# Altium project USB TO 4CHANNEL TTL CONVERTER.PrjPcb
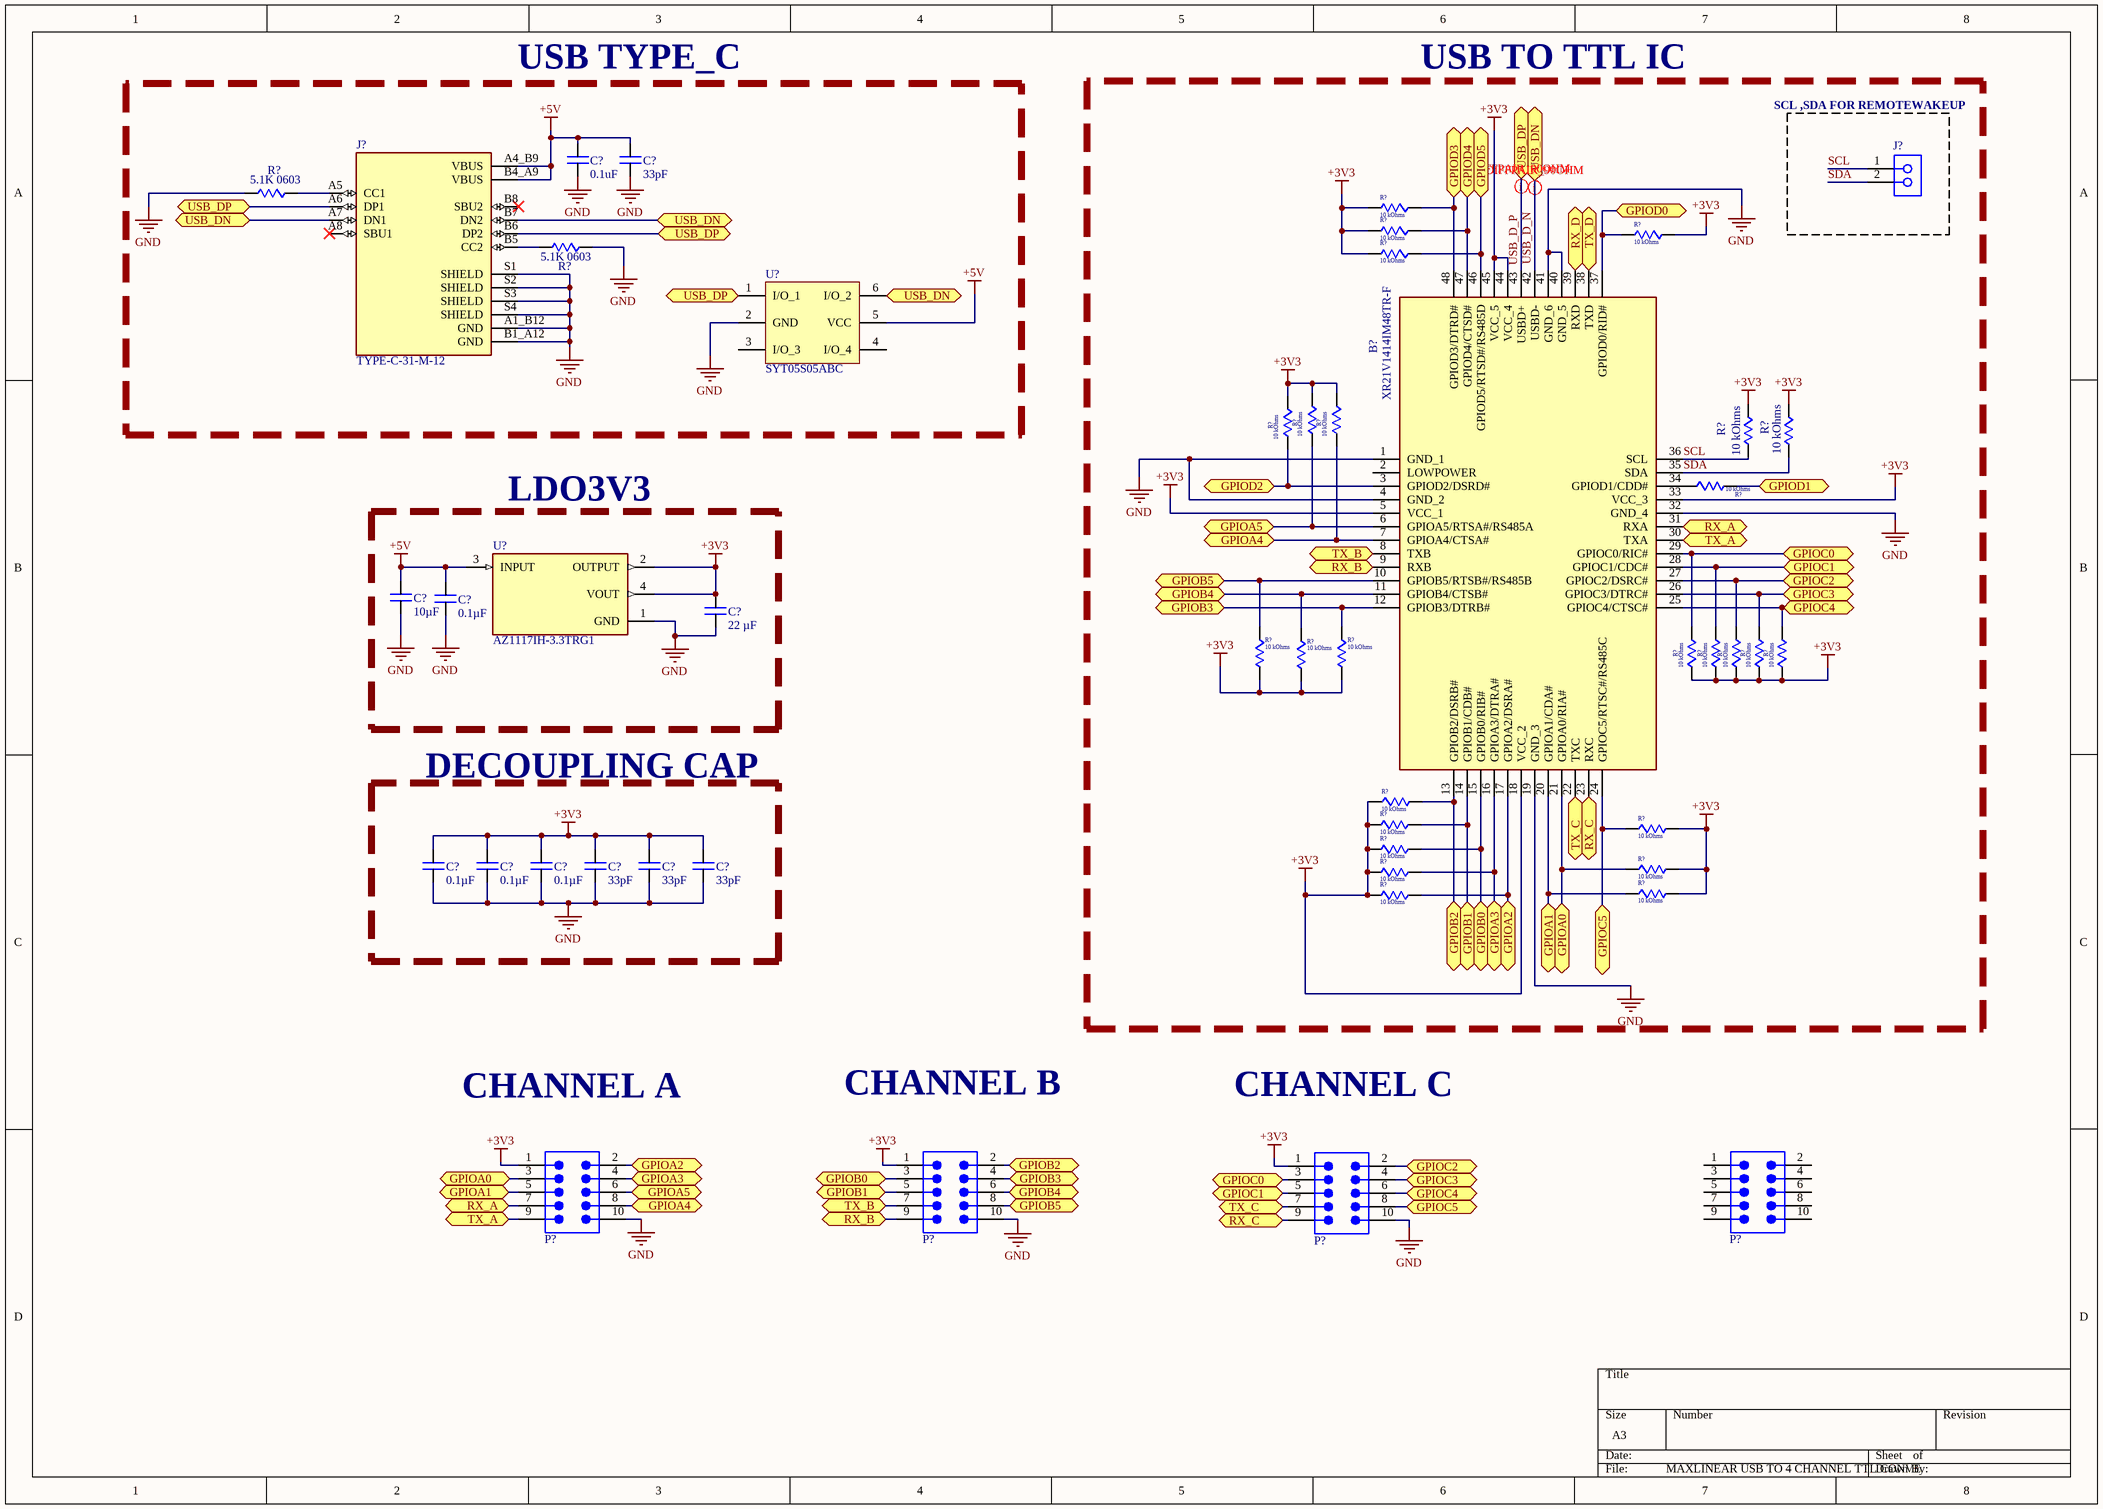
[diagram p0: MAXLINEAR USB TO 4 CHANNEL TTL CONVERTER.SchDoc]
1 sheet, 48 parts. Net scope: flat (ports and power ports of the same name join across sheets).
Board file: USB TO TTL PCB.PcbDoc

## Sheet MAXLINEAR USB TO 4 CHANNEL TTL CONVERTER.SchDoc
size A3; SheetNumber: 1; SheetTotal: 1

### Parts
(Parts that share a designator on the sheet are numbered #1, #2 ... from top to bottom, then left to right.)
B1  XR21V1414IM48TR-F  [QFP50P900X900X120-48N]
C1  value 0.1uF  [CAPC1608X90N]  (hidden comment: 0.1 µF)
C2  value 33pF  [CAPC1608X90N]  (hidden comment: 33 pF)
C3  value 0.1µF  [CAPC1608X90N]  (hidden comment: 0.1 µF)
C4  value 0.1µF  [CAPC1608X90N]  (hidden comment: 0.1 µF)
C5  value 0.1µF  [CAPC1608X90N]  (hidden comment: 0.1 µF)
C6  value 33pF  [CAPC1608X90N]  (hidden comment: 33 pF)
C7  value 33pF  [CAPC1608X90N]  (hidden comment: 33 pF)
C8  value 33pF  [CAPC1608X90N]  (hidden comment: 33 pF)
C10  value 10µF  [CAP-0805]  (hidden comment: 10 µF)
C12  value 0.1µF  [CAP-0805]  (hidden comment: 0.1 µF)
C14  22 µF  [CAPC1608X90N]
J1  TYPE-C-31-M-12  [HRO_TYPE-C-31-M-12]
J2  613002143121  [613002143121]  (value not drawn)
P?#1  61301021021  [61301021021]  (value not drawn)
P?#2  61301021021  [61301021021]  (value not drawn)
P?#3  61301021021  [61301021021]  (value not drawn)
P?#4  61301021021  [61301021021]  (value not drawn)
R1  value 5.1K 0603  [RES-0603]  (hidden comment: 5.1 kOhms ERA-3ARW512V)
R2  value 5.1K 0603  [RES-0603]  (hidden comment: 5.1 kOhms ERA-3ARW512V)
R3  10 kOhms  [RES-0603]
R4  10 kOhms  [RES-0603]
R?#1  10 kOhms  [RES-0603]
R?#2  10 kOhms  [RES-0603]
R?#3  10 kOhms  [RES-0603]
R?#4  10 kOhms  [RES-0603]
R?#5  10 kOhms  [RES-0603]
R?#6  10 kOhms  [RES-0603]
R?#7  10 kOhms  [RES-0603]
R?#8  10 kOhms  [RES-0603]
R?#9  10 kOhms  [RES-0603]
R?#10  10 kOhms  [RES-0603]
R?#11  10 kOhms  [RES-0603]
R?#12  10 kOhms  [RES-0603]
R?#13  10 kOhms  [RES-0603]
R?#14  10 kOhms  [RES-0603]
R?#15  10 kOhms  [RES-0603]
R?#16  10 kOhms  [RES-0603]
R?#17  10 kOhms  [RES-0603]
R?#18  10 kOhms  [RES-0603]
R?#19  10 kOhms  [RES-0603]
R?#20  10 kOhms  [RES-0603]
R?#21  10 kOhms  [RES-0603]
R?#22  10 kOhms  [RES-0603]
R?#23  10 kOhms  [RES-0603]
R?#24  10 kOhms  [RES-0603]
U1  SYT05S05ABC  [SYT05S05ABC]
U3  AZ1117IH-3.3TRG1  [SOT230P700X185-4N]

### Blocks framed on the sheet
USB TYPE_C: C1 C2 J1 R1 R2 U1
USB TO TTL IC: B1 J2 R3 R4 R?#1-R?#24
LDO3V3: C10 C12 C14 U3
DECOUPLING CAP: C3-C8

### Ports
GPIOA0 (bidir, see MAXLINEAR USB TO 4 CHANNEL TTL CONVERTER[2D]), GPIOA0 (bidir, see MAXLINEAR USB TO 4 CHANNEL TTL CONVERTER[6C]), GPIOA1 (bidir, see MAXLINEAR USB TO 4 CHANNEL TTL CONVERTER[2D]), GPIOA1 (bidir, see MAXLINEAR USB TO 4 CHANNEL TTL CONVERTER[6C]), GPIOA2 (bidir, see MAXLINEAR USB TO 4 CHANNEL TTL CONVERTER[3D]), GPIOA2 (bidir, see MAXLINEAR USB TO 4 CHANNEL TTL CONVERTER[6C]), GPIOA3 (bidir, see MAXLINEAR USB TO 4 CHANNEL TTL CONVERTER[3D]), GPIOA3 (bidir, see MAXLINEAR USB TO 4 CHANNEL TTL CONVERTER[6C]), GPIOA4 (bidir, see MAXLINEAR USB TO 4 CHANNEL TTL CONVERTER[3D]), GPIOA4 (bidir, see MAXLINEAR USB TO 4 CHANNEL TTL CONVERTER[5B]), GPIOA5 (bidir, see MAXLINEAR USB TO 4 CHANNEL TTL CONVERTER[3D]), GPIOA5 (bidir, see MAXLINEAR USB TO 4 CHANNEL TTL CONVERTER[5B]), GPIOB0 (bidir, see MAXLINEAR USB TO 4 CHANNEL TTL CONVERTER[4D]), GPIOB0 (bidir, see MAXLINEAR USB TO 4 CHANNEL TTL CONVERTER[6C]), GPIOB1 (bidir, see MAXLINEAR USB TO 4 CHANNEL TTL CONVERTER[4D]), GPIOB1 (bidir, see MAXLINEAR USB TO 4 CHANNEL TTL CONVERTER[6C]), GPIOB2 (bidir, see MAXLINEAR USB TO 4 CHANNEL TTL CONVERTER[4D]), GPIOB2 (bidir, see MAXLINEAR USB TO 4 CHANNEL TTL CONVERTER[6C]), GPIOB3 (bidir, see MAXLINEAR USB TO 4 CHANNEL TTL CONVERTER[4D]), GPIOB3 (bidir, see MAXLINEAR USB TO 4 CHANNEL TTL CONVERTER[5B]), GPIOB4 (bidir, see MAXLINEAR USB TO 4 CHANNEL TTL CONVERTER[4D]), GPIOB4 (bidir, see MAXLINEAR USB TO 4 CHANNEL TTL CONVERTER[5B]), GPIOB5 (bidir, see MAXLINEAR USB TO 4 CHANNEL TTL CONVERTER[4D]), GPIOB5 (bidir, see MAXLINEAR USB TO 4 CHANNEL TTL CONVERTER[5B]), GPIOC0 (bidir, see MAXLINEAR USB TO 4 CHANNEL TTL CONVERTER[5D]), GPIOC0 (bidir, see MAXLINEAR USB TO 4 CHANNEL TTL CONVERTER[7B]), GPIOC1 (bidir, see MAXLINEAR USB TO 4 CHANNEL TTL CONVERTER[5D]), GPIOC1 (bidir, see MAXLINEAR USB TO 4 CHANNEL TTL CONVERTER[7B]), GPIOC2 (bidir, see MAXLINEAR USB TO 4 CHANNEL TTL CONVERTER[6D]), GPIOC2 (bidir, see MAXLINEAR USB TO 4 CHANNEL TTL CONVERTER[7B]), GPIOC3 (bidir, see MAXLINEAR USB TO 4 CHANNEL TTL CONVERTER[6D]), GPIOC3 (bidir, see MAXLINEAR USB TO 4 CHANNEL TTL CONVERTER[7B]), GPIOC4 (bidir, see MAXLINEAR USB TO 4 CHANNEL TTL CONVERTER[6D]), GPIOC4 (bidir, see MAXLINEAR USB TO 4 CHANNEL TTL CONVERTER[7B]), GPIOC5 (bidir, see MAXLINEAR USB TO 4 CHANNEL TTL CONVERTER[6D]), GPIOC5 (bidir, see MAXLINEAR USB TO 4 CHANNEL TTL CONVERTER[7C]), GPIOD0 (bidir), GPIOD1 (bidir), GPIOD2 (bidir), GPIOD3 (bidir), GPIOD4 (bidir), GPIOD5 (bidir), RX_A (bidir, see MAXLINEAR USB TO 4 CHANNEL TTL CONVERTER[2D]), RX_A (bidir, see MAXLINEAR USB TO 4 CHANNEL TTL CONVERTER[7B]), RX_B (bidir, see MAXLINEAR USB TO 4 CHANNEL TTL CONVERTER[4D]), RX_B (bidir, see MAXLINEAR USB TO 4 CHANNEL TTL CONVERTER[5B]), RX_C (bidir, see MAXLINEAR USB TO 4 CHANNEL TTL CONVERTER[5D]), RX_C (bidir, see MAXLINEAR USB TO 4 CHANNEL TTL CONVERTER[7C]), RX_D (bidir), TX_A (bidir, see MAXLINEAR USB TO 4 CHANNEL TTL CONVERTER[2D]), TX_A (bidir, see MAXLINEAR USB TO 4 CHANNEL TTL CONVERTER[7B]), TX_B (bidir, see MAXLINEAR USB TO 4 CHANNEL TTL CONVERTER[4D]), TX_B (bidir, see MAXLINEAR USB TO 4 CHANNEL TTL CONVERTER[5B]), TX_C (bidir, see MAXLINEAR USB TO 4 CHANNEL TTL CONVERTER[5D]), TX_C (bidir, see MAXLINEAR USB TO 4 CHANNEL TTL CONVERTER[7C]), TX_D (bidir), USB_DN (bidir, see MAXLINEAR USB TO 4 CHANNEL TTL CONVERTER[1A], MAXLINEAR USB TO 4 CHANNEL TTL CONVERTER[3A], MAXLINEAR USB TO 4 CHANNEL TTL CONVERTER[4A]), USB_DN (bidir, see MAXLINEAR USB TO 4 CHANNEL TTL CONVERTER[1A], MAXLINEAR USB TO 4 CHANNEL TTL CONVERTER[3A], MAXLINEAR USB TO 4 CHANNEL TTL CONVERTER[6A]), USB_DN (bidir, see MAXLINEAR USB TO 4 CHANNEL TTL CONVERTER[1A], MAXLINEAR USB TO 4 CHANNEL TTL CONVERTER[4A], MAXLINEAR USB TO 4 CHANNEL TTL CONVERTER[6A]), USB_DN (bidir, see MAXLINEAR USB TO 4 CHANNEL TTL CONVERTER[3A], MAXLINEAR USB TO 4 CHANNEL TTL CONVERTER[4A], MAXLINEAR USB TO 4 CHANNEL TTL CONVERTER[6A]), USB_DP (bidir, see MAXLINEAR USB TO 4 CHANNEL TTL CONVERTER[1A], MAXLINEAR USB TO 4 CHANNEL TTL CONVERTER[3A]), USB_DP (bidir, see MAXLINEAR USB TO 4 CHANNEL TTL CONVERTER[1A], MAXLINEAR USB TO 4 CHANNEL TTL CONVERTER[3A], MAXLINEAR USB TO 4 CHANNEL TTL CONVERTER[6A]), USB_DP (bidir, see MAXLINEAR USB TO 4 CHANNEL TTL CONVERTER[3A], MAXLINEAR USB TO 4 CHANNEL TTL CONVERTER[6A])

### Nets
+3V3: B1.5(VCC_1) B1.18(VCC_2) B1.33(VCC_3) B1.44(VCC_4) B1.45(VCC_5) C3.1 C4.1 C5.1 C6.1 C7.1 C8.1 C14.1 P?#1.1 P?#2.1 P?#3.1 R3.2 R4.2 R?#1.1 R?#2.1 R?#3.2 R?#4.1 R?#5.2 R?#6.2 R?#7.2 R?#9.1 R?#10.1 R?#11.1 R?#12.2 R?#13.2 R?#14.2 R?#15.2 R?#16.2 R?#17.2 R?#18.2 R?#19.1 R?#20.2 R?#21.2 R?#22.1 R?#23.2 R?#24.1 U3.2(OUTPUT) U3.4(VOUT)
+5V: C1.1 C2.1 C10.1 C12.1 J1.A4_B9(VBUS) J1.B4_A9(VBUS) U1.5(VCC) U3.3(INPUT)
GND: B1.1(GND_1) B1.4(GND_2) B1.19(GND_3) B1.32(GND_4) B1.40(GND_5) B1.41(GND_6) C1.2 C2.2 C3.2 C4.2 C5.2 C6.2 C7.2 C8.2 C10.2 C12.2 C14.2 J1.A1_B12(GND) J1.B1_A12(GND) J1.S1(SHIELD) J1.S2(SHIELD) J1.S3(SHIELD) J1.S4(SHIELD) P?#1.10 P?#2.10 P?#3.10 R1.1 R2.2 U1.2(GND) U3.1(GND)
SCL: B1.36(SCL) J2.1 R3.1
SDA: B1.35(SDA) J2.2 R4.1
USB_D_N: B1.42(USBD-) J1.A7(DN1) J1.B7(DN2) U1.6(I/O_2) ; port USB_DN
USB_D_P: B1.43(USBD+) J1.A6(DP1) J1.B6(DP2) U1.1(I/O_1) ; port USB_DP
NetB1_3: B1.3(GPIOD2/DSRD#) R?#7.1 ; port GPIOD2
NetB1_6: B1.6(GPIOA5/RTSA#/RS485A) P?#1.6 R?#5.1 ; port GPIOA5
NetB1_7: B1.7(GPIOA4/CTSA#) P?#1.8 R?#6.1 ; port GPIOA4
NetB1_8: B1.8(TXB) P?#2.7 ; port TX_B
NetB1_9: B1.9(RXB) P?#2.9 ; port RX_B
NetB1_10: B1.10(GPIOB5/RTSB#/RS485B) P?#2.8 R?#9.2 ; port GPIOB5
NetB1_11: B1.11(GPIOB4/CTSB#) P?#2.6 R?#10.2 ; port GPIOB4
NetB1_12: B1.12(GPIOB3/DTRB#) P?#2.4 R?#11.2 ; port GPIOB3
NetB1_13: B1.13(GPIOB2/DSRB#) P?#2.2 R?#17.1 ; port GPIOB2
NetB1_14: B1.14(GPIOB1/CDB#) P?#2.5 R?#18.1 ; port GPIOB1
NetB1_15: B1.15(GPIOB0/RIB#) P?#2.3 R?#20.1 ; port GPIOB0
NetB1_16: B1.16(GPIOA3/DTRA#) P?#1.4 R?#21.1 ; port GPIOA3
NetB1_17: B1.17(GPIOA2/DSRA#) P?#1.2 R?#23.1 ; port GPIOA2
NetB1_20: B1.20(GPIOA1/CDA#) P?#1.5 R?#24.2 ; port GPIOA1
NetB1_21: B1.21(GPIOA0/RIA#) P?#1.3 R?#22.2 ; port GPIOA0
NetB1_22: B1.22(TXC) P?#3.7 ; port TX_C
NetB1_23: B1.23(RXC) P?#3.9 ; port RX_C
NetB1_24: B1.24(GPIOC5/RTSC#/RS485C) P?#3.8 R?#19.2 ; port GPIOC5
NetB1_25: B1.25(GPIOC4/CTSC#) P?#3.6 R?#16.1 ; port GPIOC4
NetB1_26: B1.26(GPIOC3/DTRC#) P?#3.4 R?#15.1 ; port GPIOC3
NetB1_27: B1.27(GPIOC2/DSRC#) P?#3.2 R?#14.1 ; port GPIOC2
NetB1_28: B1.28(GPIOC1/CDC#) P?#3.5 R?#13.1 ; port GPIOC1
NetB1_29: B1.29(GPIOC0/RIC#) P?#3.3 R?#12.1 ; port GPIOC0
NetB1_30: B1.30(TXA) P?#1.9 ; port TX_A
NetB1_31: B1.31(RXA) P?#1.7 ; port RX_A
NetB1_34: B1.34(GPIOD1/CDD#) R?#8.2
NetB1_37: B1.37(GPIOD0/RID#) R?#3.1 ; port GPIOD0
NetB1_38: B1.38(TXD) ; port TX_D
NetB1_39: B1.39(RXD) ; port RX_D
NetB1_46: B1.46(GPIOD5/RTSD#/RS485D) R?#4.2 ; port GPIOD5
NetB1_47: B1.47(GPIOD4/CTSD#) R?#2.2 ; port GPIOD4
NetB1_48: B1.48(GPIOD3/DTRD#) R?#1.2 ; port GPIOD3
NetJ1_A5: J1.A5(CC1) R1.2
NetJ1_B5: J1.B5(CC2) R2.1
NetR?#8_1: R?#8.1 ; port GPIOD1

Not connected (* = marked no-connect by the designer): B1 2(LOWPOWER); J1 A8(SBU1)* B8(SBU2)*; P?#4 1 2 3 4 5 6 7 8 9 10; U1 3(I/O_3) 4(I/O_4)

### Layout directives
differential pair: USB_D_N, USB_D_P

### Notes on the sheet
- SCL ,SDA FOR REMOTEWAKEUP
- CHANNEL A
- CHANNEL B
- CHANNEL C

### Library data of the parts
B1 = XR21V1414IM48-F: USB Interface IC 4-Ch 12Mbps 48MHz Internal clock; UART; Manufacturer_Name: MaxLinear, Inc.; Geometry.Height: 1.2mm; Manufacturer_Part_Number: XR21V1414IM48-F; Mouser Part Number: 701-XR21V1414IM48-F; Mouser Price/Stock: https://www.mouser.co.uk/ProductDetail/MaxLinear/XR21V1414IM48-F?qs=ffYlDyDpdDVv7svdbXLjeg%3D%3D; Arrow Part Number: XR21V1414IM48-F; Arrow Price/Stock: https://www.arrow.com/en/products/xr21v1414im48-f/maxlinear-inc?region=nac; Datasheet Link: https://www.maxlinear.com/document?id=1416
C1 = CC0603KRX7R0BB104: 0.1 µF ±10% 100V Ceramic Capacitor X7R 0603 (1608 Metric); Supplier 1: Future Electronics; Supplier Part Number 1: 5049188; Package: 0603
C2 C6-C8 = KGM15ACG1H330JT: 33 pF ±5% 50V Ceramic Capacitor C0G, NP0 0603 (1608 Metric); Supplier 1: Arrow Electronics; Supplier Part Number 1: KGM15ACG1H330JT; Package: 0603
C3-C5 = C0603C104J5RAC7867: 0.1 µF ±5% 50V Ceramic Capacitor X7R 0603 (1608 Metric); Supplier 1: Mouser; Supplier Part Number 1: 81-GRM21BR61H106KE3K; Package: 0805
C10 = GRM21BR61H106KE43K: 10 µF ±10% 50V Ceramic Capacitor X5R 0805 (2012 Metric); Supplier 1: Mouser; Supplier Part Number 1: 80-C0805C104K1R; Package: 0805
C12 = C0805C104K1RACTU: 0.1 µF ±10% 100V Ceramic Capacitor X7R 0805 (2012 Metric); Supplier 1: Future Electronics; Supplier Part Number 1: 8126166; Package: 0603
C14 = GRM188R61A226ME15J: 22 µF ±20% 10V Ceramic Capacitor X5R 0603 (1608 Metric); Value: 22µF; Supplier 1: Mouser; Supplier Part Number 1: 80-C0603C104J5R; Package: 0603
J1 = TYPE-C-31-M-12: USB Connectors 24 Receptacle 1 8.94*7.3mm RoHS; MF: HRO Electronics Co., Ltd.; Manufacturer Part Number: 613002143121; Category: Board-to-Board Connectors; Match Code: WR-PHD; ComponentLink1Description: Website Link; ComponentLink1URL: https://www.we-online.com/redexpert/article/613002143121?ad; ComponentLink2Description: Datasheet Link; ComponentLink2URL: https://www.we-online.com/redexpert/spec/613002143121?ad; Mount: Through Hole; Operating Temperature Max: 125°C; Operating Temperature Min: -40°C; Packaging: Tray; Gender: Socket Header; Number of Pins: 2; Number of Rows: 1; Orientation: Angled; Pitch: 2.54mm
J2 = 613002143121: WR-PHD Socket Header, THT, Angled, pitch 2.54mm, 1 Row, 2P; Manufacturer: Wurth Elektronik; Contact Resistance: 20mOhm; Rated Current: 3A; Working Voltage: 250V; Withstanding Voltage: 500V; Price: None; Value: *; SnapEDA_Link: https://www.snapeda.com/parts/TYPE-C-31-M-12/HRO+Electronics+Co.%252C+Ltd./view-part/?ref=snap; Package: Package; Availability: Not in stock; Check_prices: https://www.snapeda.com/parts/TYPE-C-31-M-12/HRO+Electronics+Co.%252C+Ltd./view-part/?ref=eda; MP: TYPE-C-31-M-12
P?#1-P?#4 = 61301021021: WR-PHD Pin Header, THT, Angled, pitch 2.54mm, 2 Row, 10P; Manufacturer: Wurth Elektronik; Contact Resistance: 20mOhm; Rated Current: 3A; Working Voltage: 250V; Withstanding Voltage: 500V; Manufacturer Part Number: 61301021021; Category: Board-to-Board Connectors; Match Code: WR-PHD; ComponentLink1Description: Website Link; ComponentLink1URL: https://www.we-online.com/redexpert/article/61301021021?ad; ComponentLink2Description: Datasheet Link; ComponentLink2URL: https://www.we-online.com/redexpert/spec/61301021021?ad; Mount: Through Hole; Operating Temperature Max: 105°C; Operating Temperature Min: -40°C; Packaging: Bag; Gender: Pin Header; Number of Pins: 10; Number of Rows: 2; Orientation: Angled; Pitch: 2.54mm
R1 R2 = RC0603FR-071KL: ERA-3ARW512V / 5.1 kOhms ±0.05% 0.1W, 1/10W Chip Resistor 0603 (1608 Metric) Automotive AEC-Q200 Thin Film; Supplier 1: Future Electronics; Supplier Part Number 1: 4016291; Package: 0603
R3 R4 R?#1-R?#24 = RC0603FR-0710KL: 10 kOhms ±1% 0.1W, 1/10W Chip Resistor 0603 (1608 Metric) Moisture Resistant Thick Film; Supplier 1: Future Electronics; Supplier Part Number 1: 4023214; Package: 0603; Value: 10 kOhms
U1 = SYT05S05ABC: ESD Protection - USB2.0 Power and Data Line Protection
U3 = AZ1117IH-3.3TRG1: Linear Voltage Regulator IC Positive Fixed 1 Output 1A SOT-223-3; MF: Diodes Inc.; Check_prices: https://www.snapeda.com/parts/AZ1117IH-3.3TRG1/Diodes+Inc./view-part/?ref=eda; Value: *; Availability: In Stock; MP: AZ1117IH-3.3TRG1; Price: None; Package: SOT-223 Diodes Inc.; SnapEDA_Link: https://www.snapeda.com/parts/AZ1117IH-3.3TRG1/Diodes+Inc./view-part/?ref=snap; Purchase-URL: https://pricing.snapeda.com/search/part/AZ1117IH-3.3TRG1/?ref=eda